# EAGLE schematic shimboard_revC_V4 (EAGLE 9.1.1)

## Sheet 1 of 2
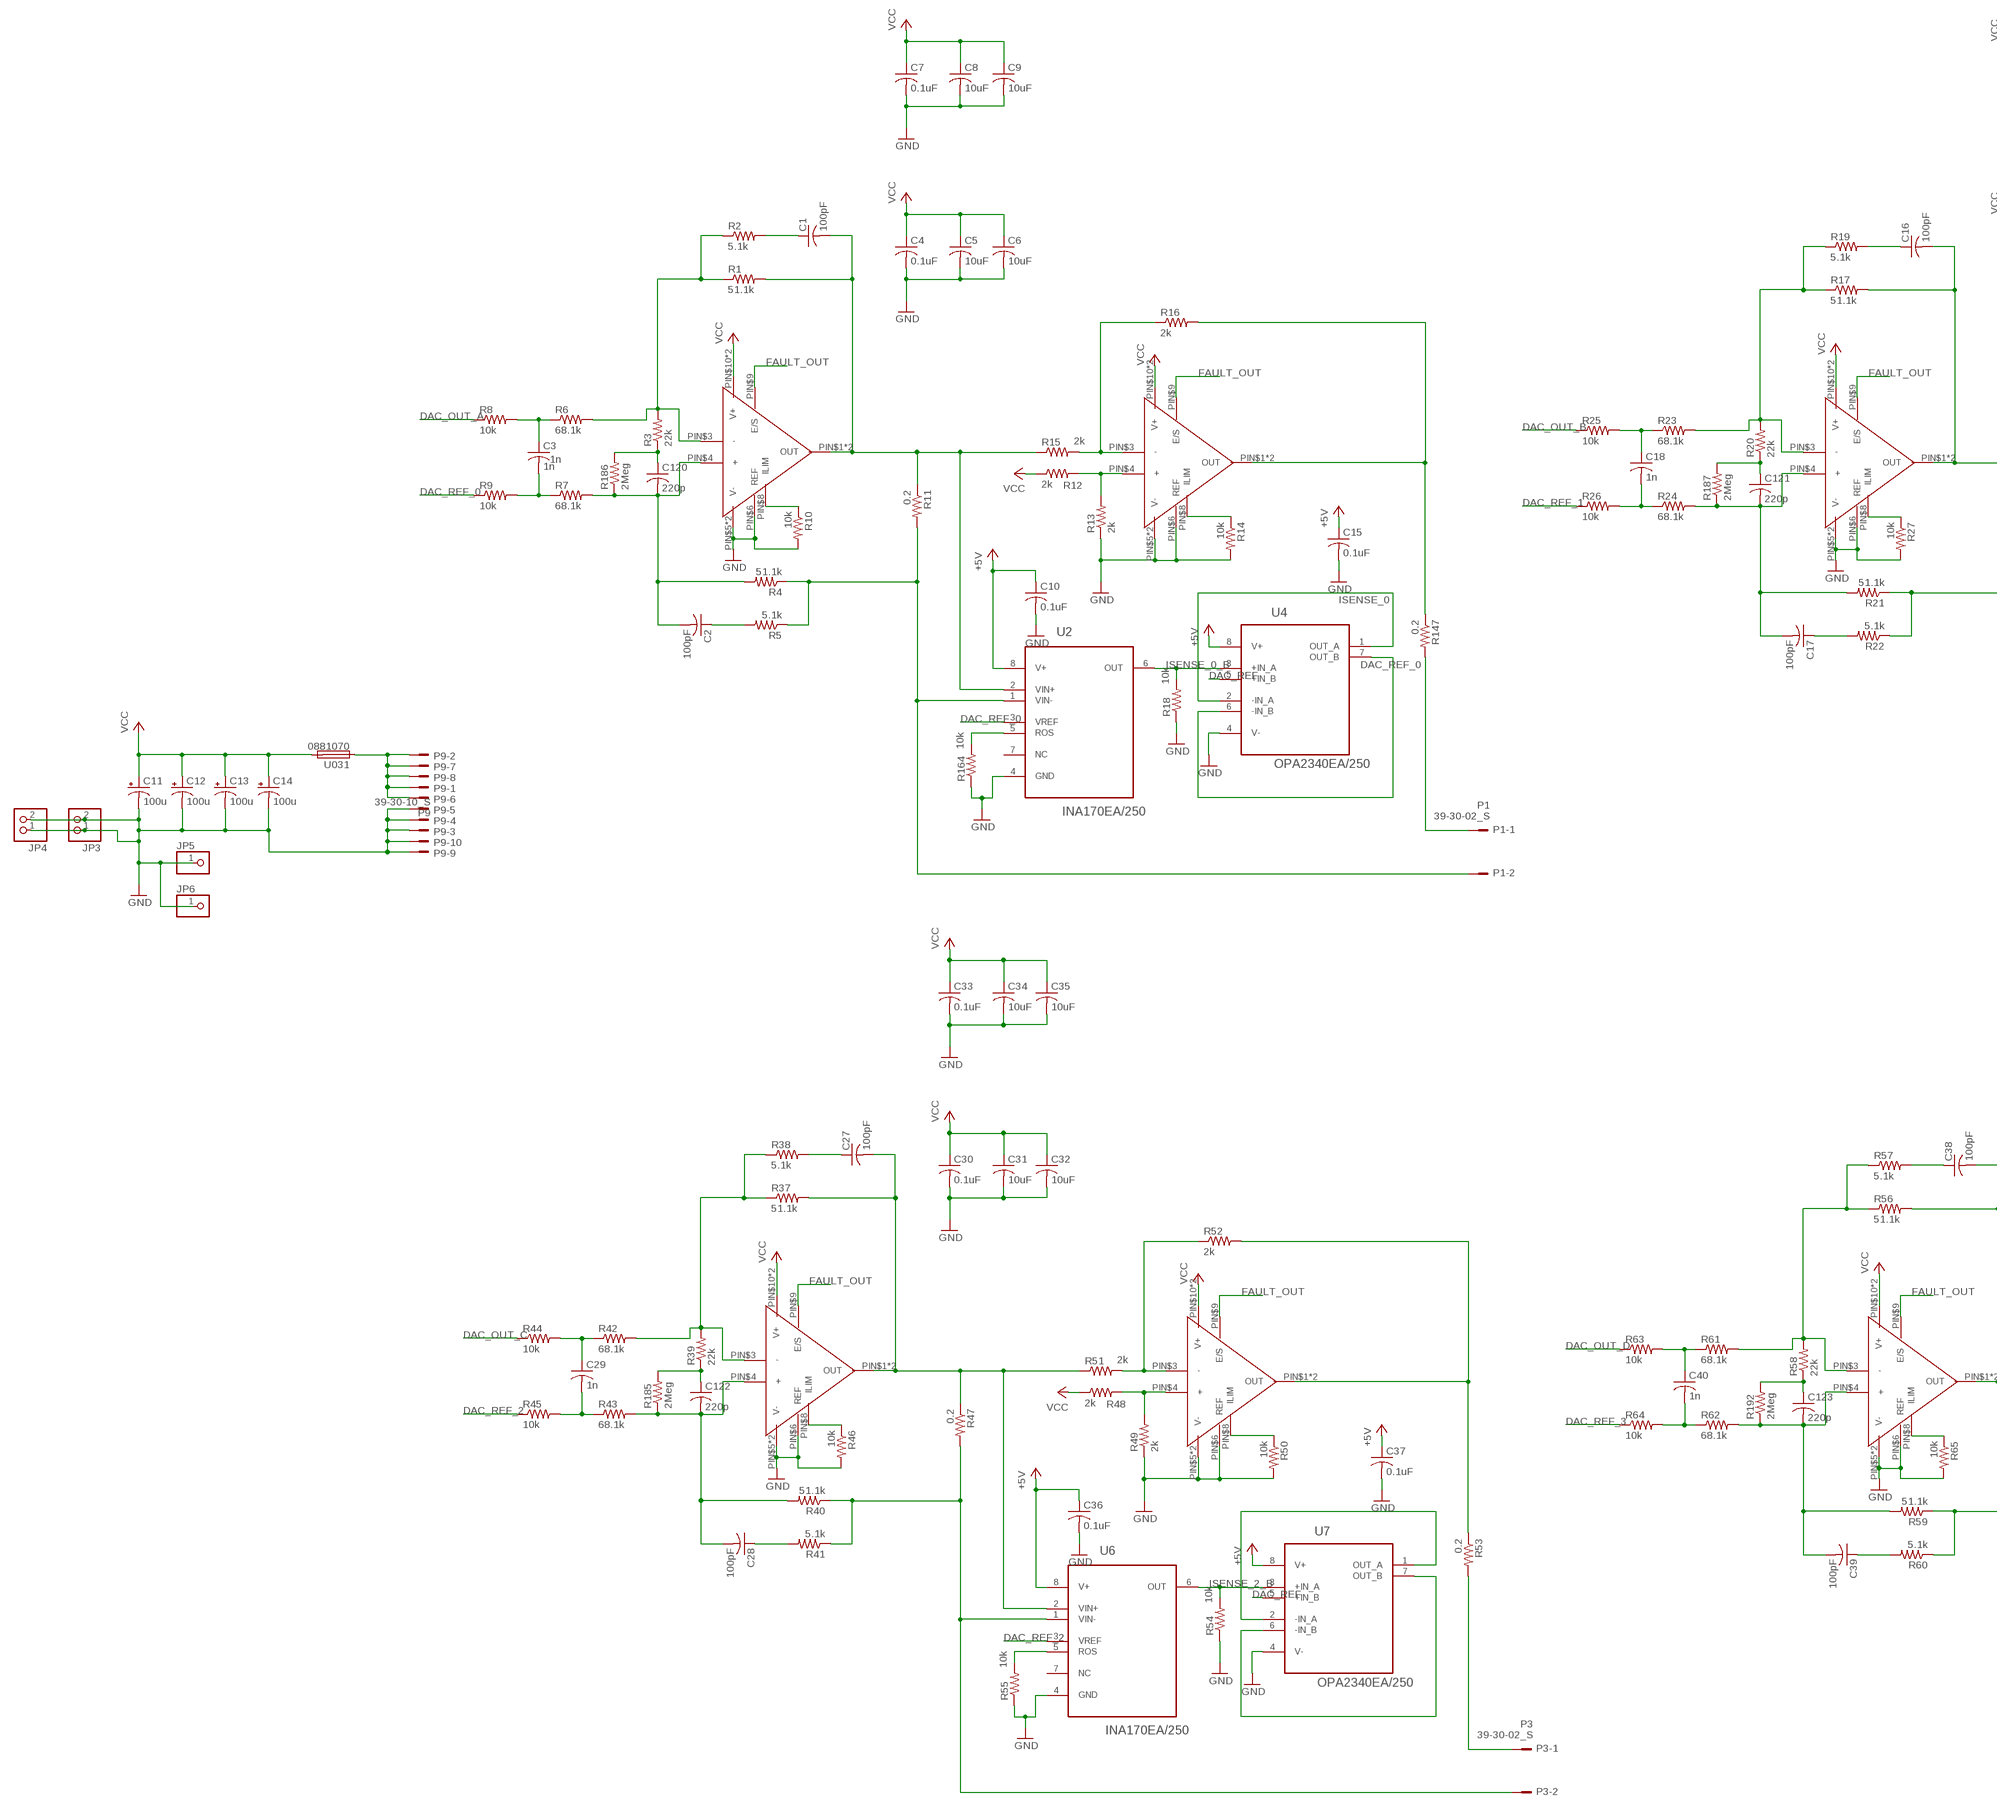
[diagram p0: schematic, sheet 1, part 1 of 3]
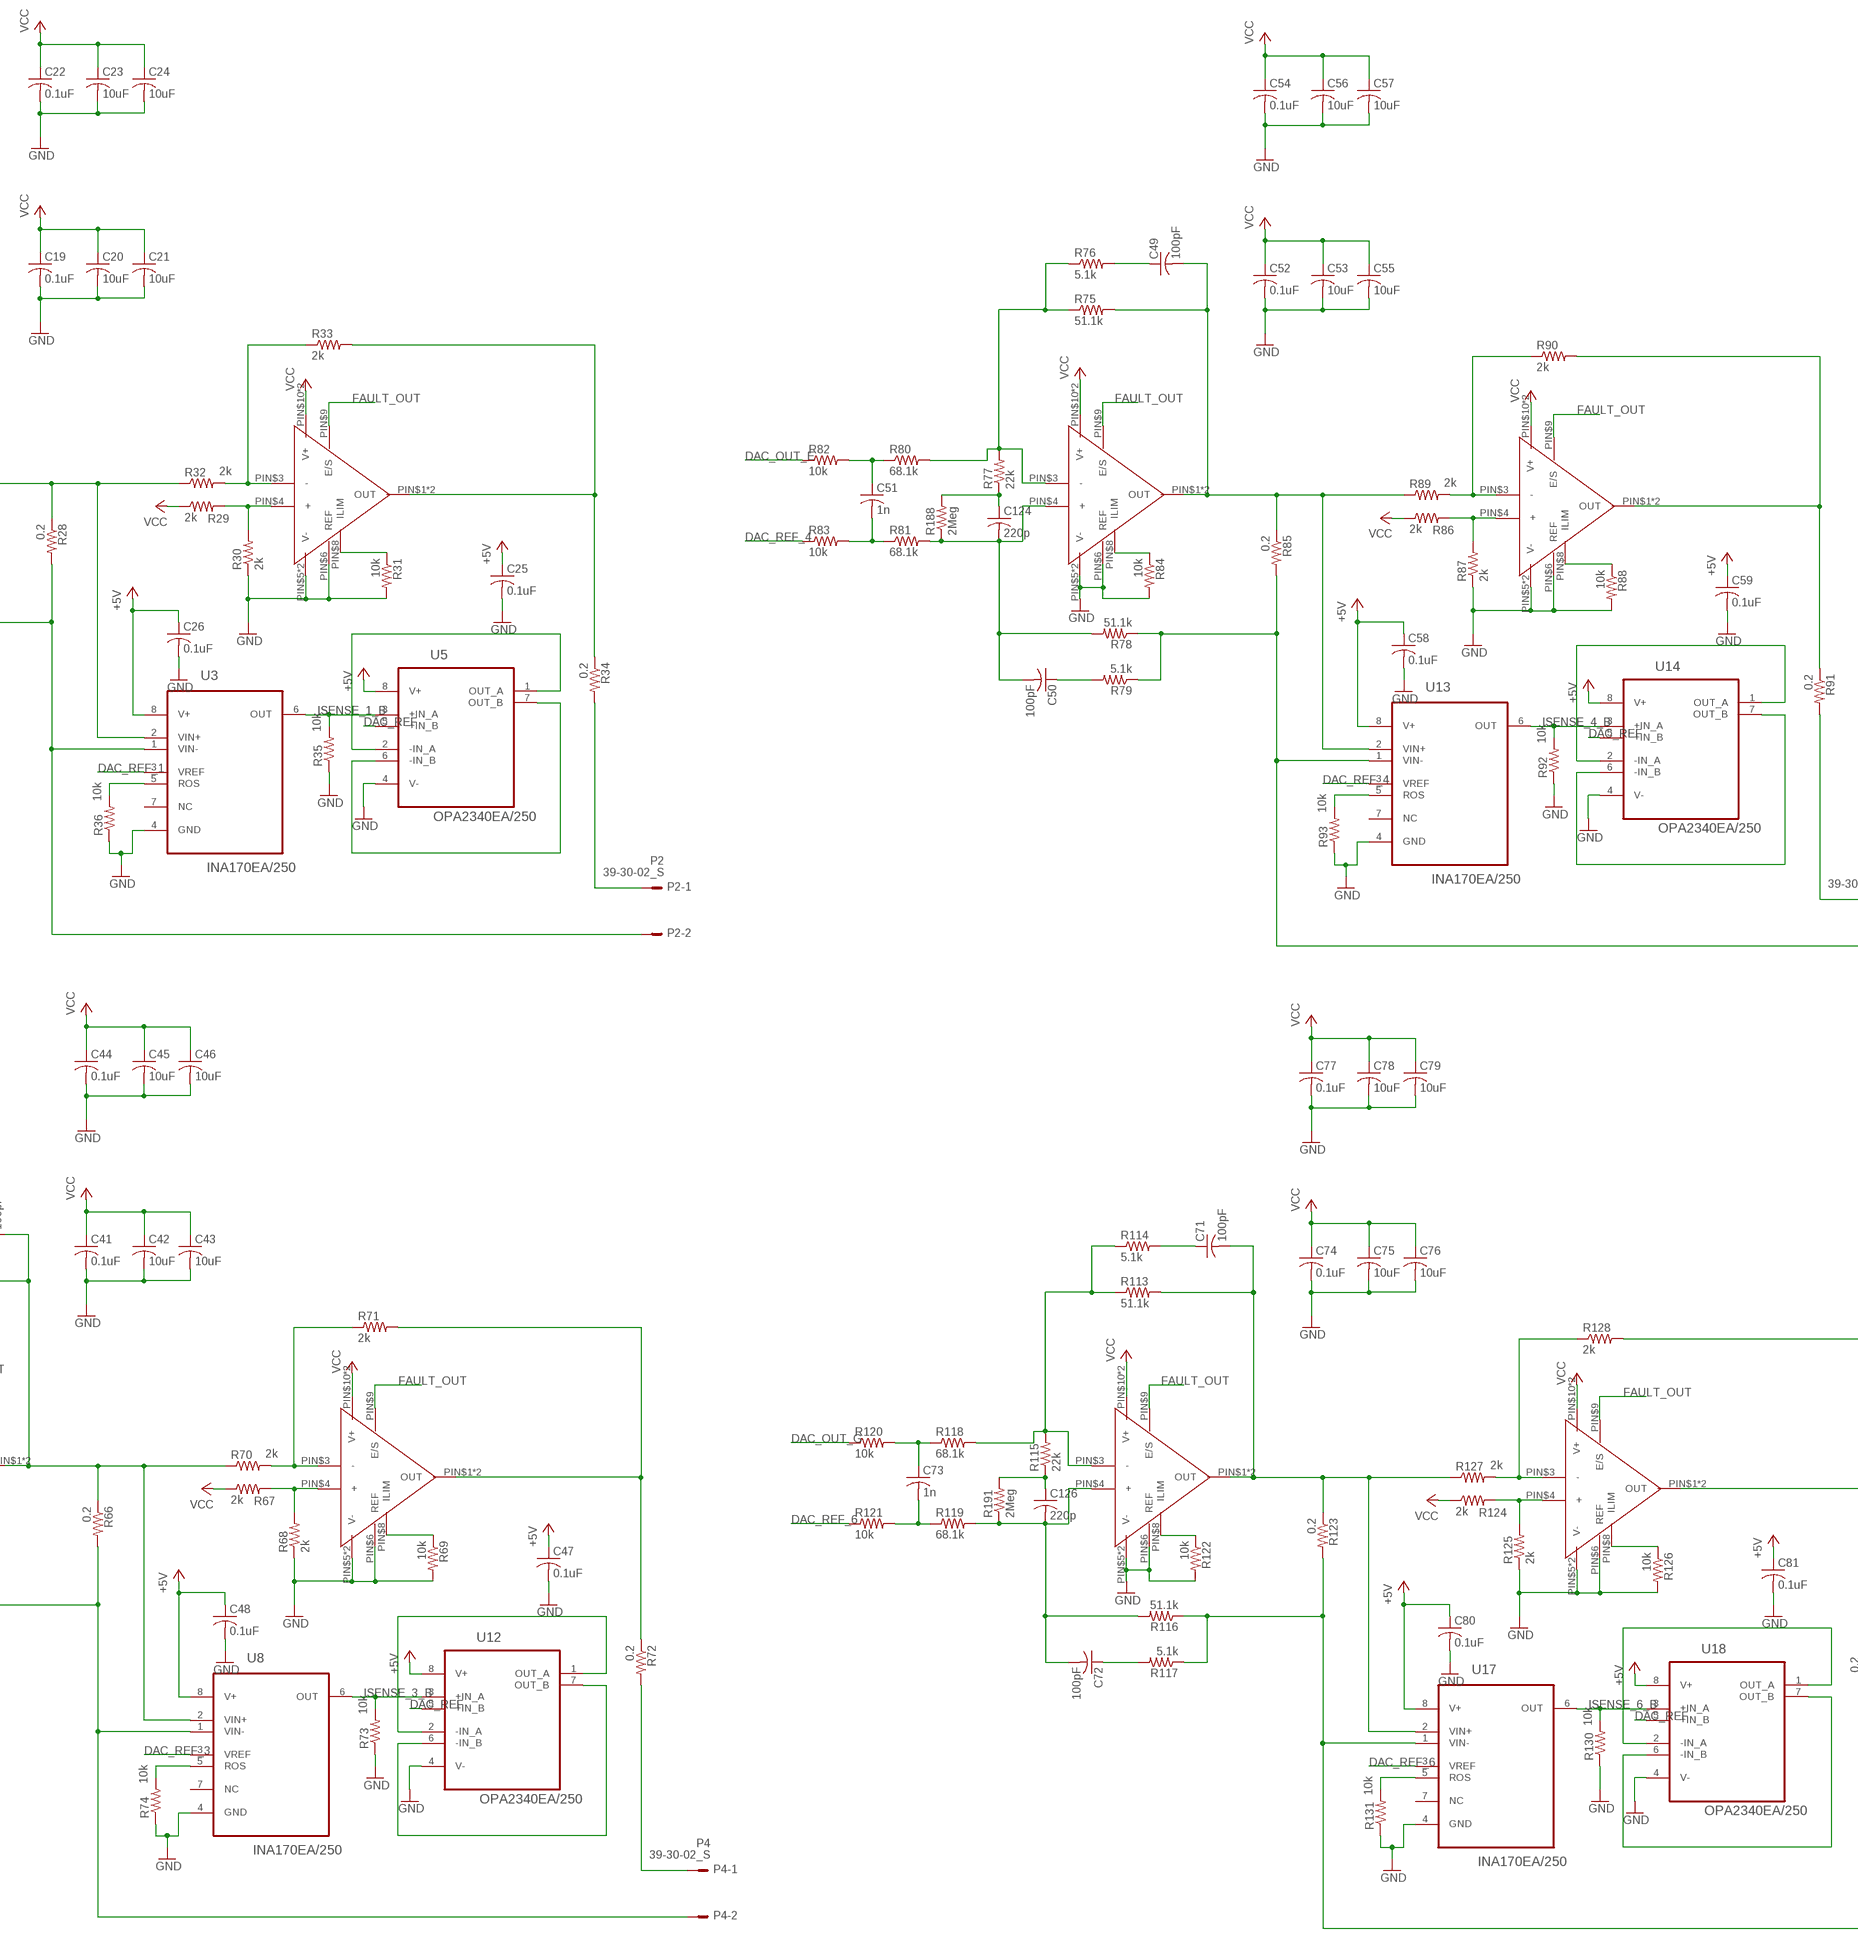
[diagram p1: schematic, sheet 1, part 2 of 3]
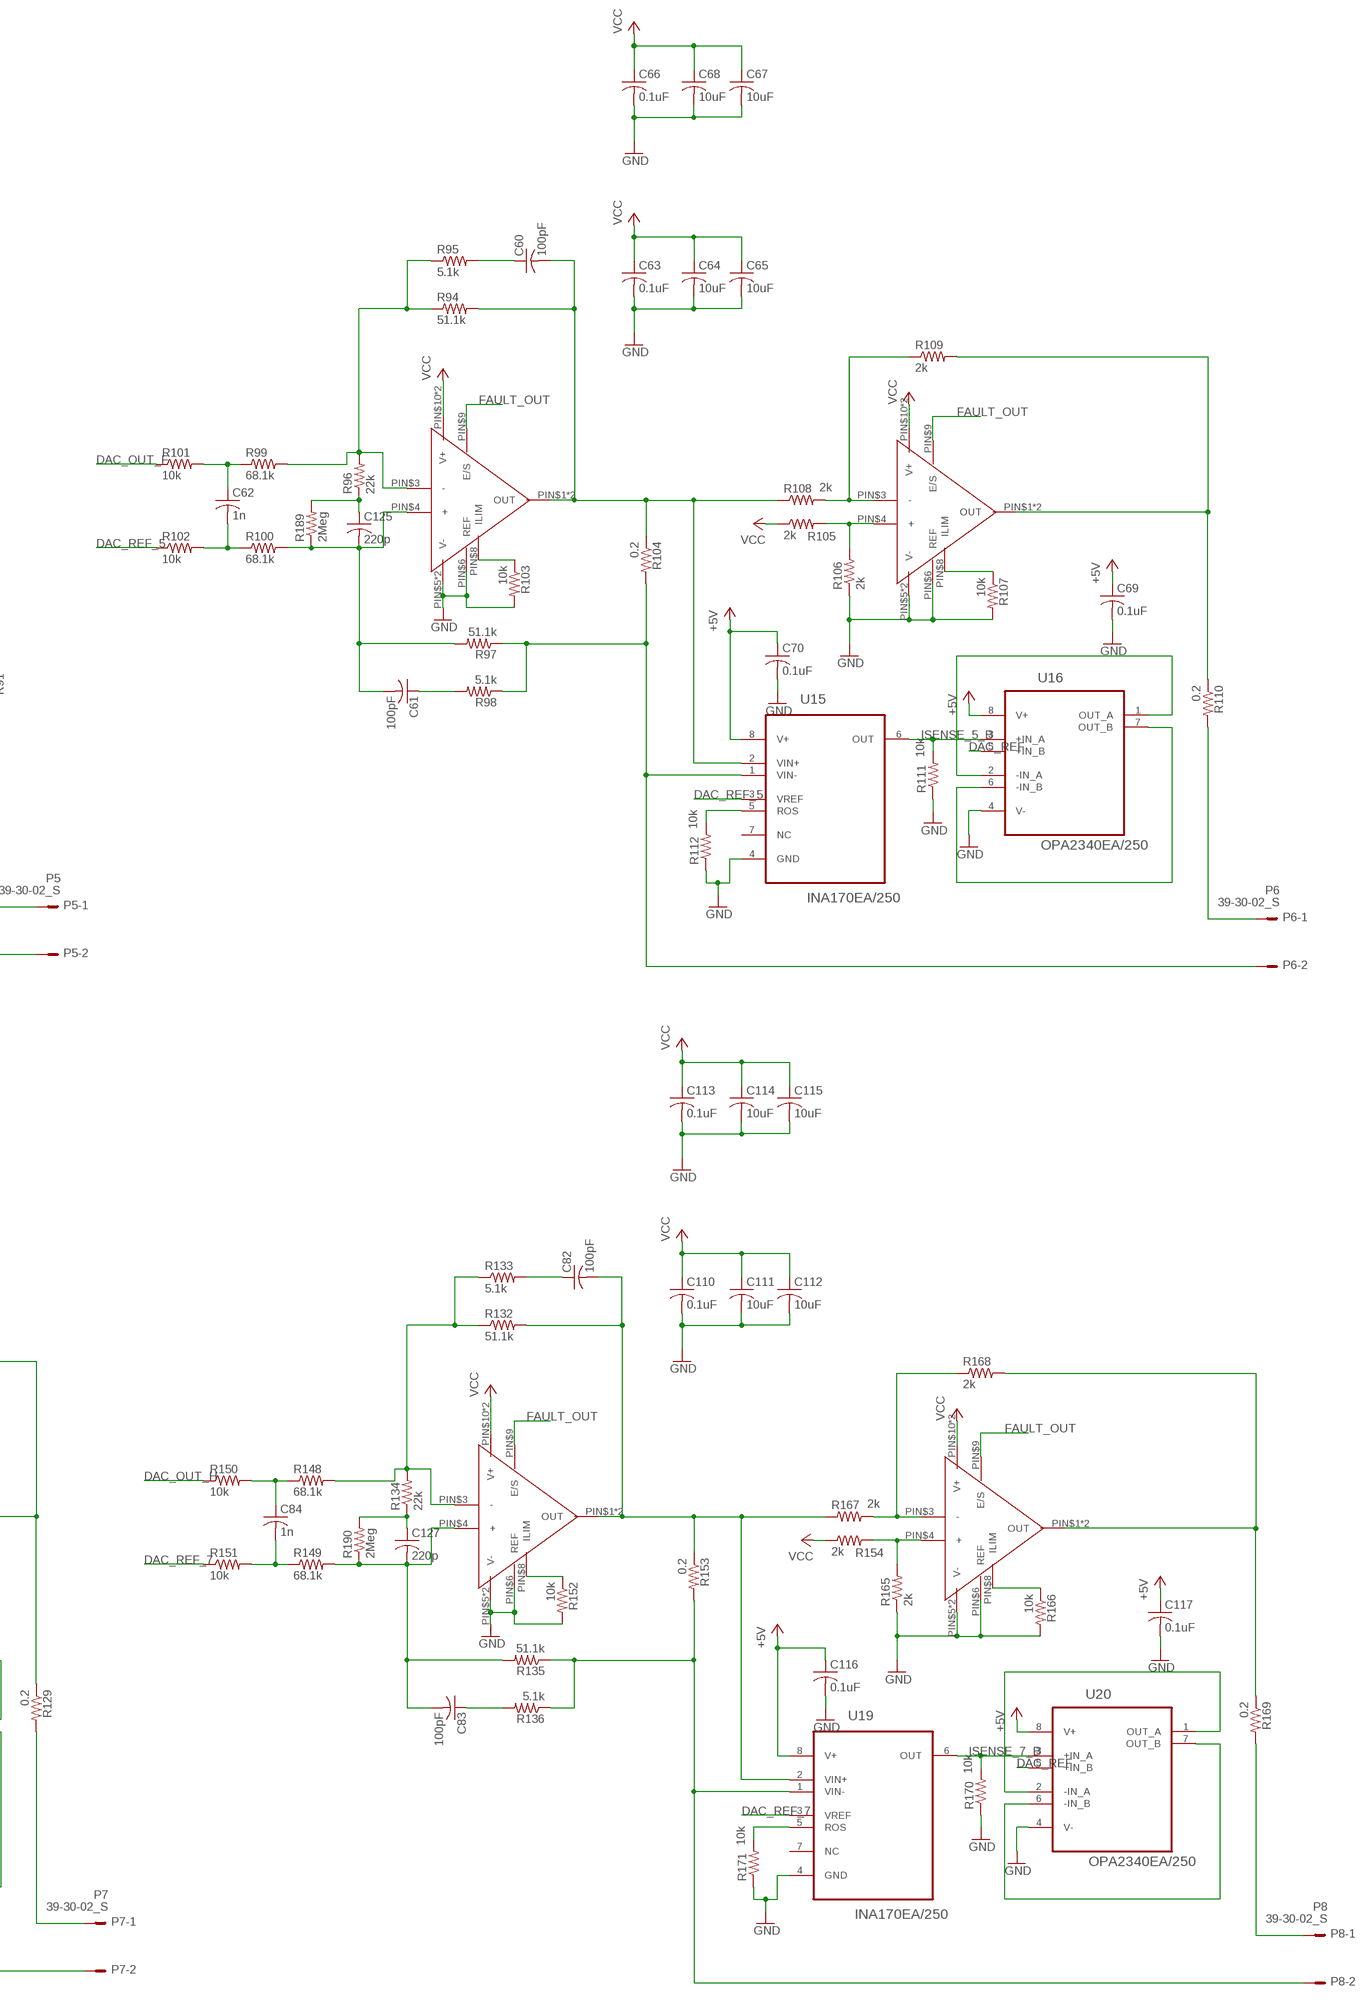
[diagram p2: schematic, sheet 1, part 3 of 3]

### Parts
C1  100pF  C-USC0805  [C0805]
C2  100pF  C-USC0805  [C0805]
C3  1n  C-USC0805  [C0805]
C4  0.1uF  C-USC0805  [C0805]
C5  10uF  C-USC1206  [C1206]
C6  10uF  C-USC1206  [C1206]
C7  0.1uF  C-USC0805  [C0805]
C8  10uF  C-USC1206  [C1206]
C9  10uF  C-USC1206  [C1206]
C10  0.1uF  C-USC0805  [C0805]
C11  100u  CPOL-USD/7343-31W  [D/7343-31W]
C12  100u  CPOL-USD/7343-31W  [D/7343-31W]
C13  100u  CPOL-USD/7343-31W  [D/7343-31W]
C14  100u  CPOL-USD/7343-31W  [D/7343-31W]
C15  0.1uF  C-USC0805  [C0805]
C16  100pF  C-USC0805  [C0805]
C17  100pF  C-USC0805  [C0805]
C18  1n  C-USC0805  [C0805]
C19  0.1uF  C-USC0805  [C0805]
C20  10uF  C-USC1206  [C1206]
C21  10uF  C-USC1206  [C1206]
C22  0.1uF  C-USC0805  [C0805]
C23  10uF  C-USC1206  [C1206]
C24  10uF  C-USC1206  [C1206]
C25  0.1uF  C-USC0805  [C0805]
C26  0.1uF  C-USC0805  [C0805]
C27  100pF  C-USC0805  [C0805]
C28  100pF  C-USC0805  [C0805]
C29  1n  C-USC0805  [C0805]
C30  0.1uF  C-USC0805  [C0805]
C31  10uF  C-USC1206  [C1206]
C32  10uF  C-USC1206  [C1206]
C33  0.1uF  C-USC0805  [C0805]
C34  10uF  C-USC1206  [C1206]
C35  10uF  C-USC1206  [C1206]
C36  0.1uF  C-USC0805  [C0805]
C37  0.1uF  C-USC0805  [C0805]
C38  100pF  C-USC0805  [C0805]
C39  100pF  C-USC0805  [C0805]
C40  1n  C-USC0805  [C0805]
C41  0.1uF  C-USC0805  [C0805]
C42  10uF  C-USC1206  [C1206]
C43  10uF  C-USC1206  [C1206]
C44  0.1uF  C-USC0805  [C0805]
C45  10uF  C-USC1206  [C1206]
C46  10uF  C-USC1206  [C1206]
C47  0.1uF  C-USC0805  [C0805]
C48  0.1uF  C-USC0805  [C0805]
C49  100pF  C-USC0805  [C0805]
C50  100pF  C-USC0805  [C0805]
C51  1n  C-USC0805  [C0805]
C52  0.1uF  C-USC0805  [C0805]
C53  10uF  C-USC1206  [C1206]
C54  0.1uF  C-USC0805  [C0805]
C55  10uF  C-USC1206  [C1206]
C56  10uF  C-USC1206  [C1206]
C57  10uF  C-USC1206  [C1206]
C58  0.1uF  C-USC0805  [C0805]
C59  0.1uF  C-USC0805  [C0805]
C60  100pF  C-USC0805  [C0805]
C61  100pF  C-USC0805  [C0805]
C62  1n  C-USC0805  [C0805]
C63  0.1uF  C-USC0805  [C0805]
C64  10uF  C-USC1206  [C1206]
C65  10uF  C-USC1206  [C1206]
C66  0.1uF  C-USC0805  [C0805]
C67  10uF  C-USC1206  [C1206]
C68  10uF  C-USC1206  [C1206]
C69  0.1uF  C-USC0805  [C0805]
C70  0.1uF  C-USC0805  [C0805]
C71  100pF  C-USC0805  [C0805]
C72  100pF  C-USC0805  [C0805]
C73  1n  C-USC0805  [C0805]
C74  0.1uF  C-USC0805  [C0805]
C75  10uF  C-USC1206  [C1206]
C76  10uF  C-USC1206  [C1206]
C77  0.1uF  C-USC0805  [C0805]
C78  10uF  C-USC1206  [C1206]
C79  10uF  C-USC1206  [C1206]
C80  0.1uF  C-USC0805  [C0805]
C81  0.1uF  C-USC0805  [C0805]
C82  100pF  C-USC0805  [C0805]
C83  100pF  C-USC0805  [C0805]
C84  1n  C-USC0805  [C0805]
C110  0.1uF  C-USC0805  [C0805]
C111  10uF  C-USC1206  [C1206]
C112  10uF  C-USC1206  [C1206]
C113  0.1uF  C-USC0805  [C0805]
C114  10uF  C-USC1206  [C1206]
C115  10uF  C-USC1206  [C1206]
C116  0.1uF  C-USC0805  [C0805]
C117  0.1uF  C-USC0805  [C0805]
C120  220p  C-USC0805  [C0805]
C121  220p  C-USC0805  [C0805]
C122  220p  C-USC0805  [C0805]
C123  220p  C-USC0805  [C0805]
C124  220p  C-USC0805  [C0805]
C125  220p  C-USC0805  [C0805]
C126  220p  C-USC0805  [C0805]
C127  220p  C-USC0805  [C0805]
JP3  PINHD-1X2  [1X02]
JP4  PINHD-1X2  [1X02]
JP5  PINHD-1X1  [1X01]
JP6  PINHD-1X1  [1X01]
P1  39-30-02_S  [39-30-?02?]
P2  39-30-02_S  [39-30-?02?]
P3  39-30-02_S  [39-30-?02?]
P4  39-30-02_S  [39-30-?02?]
P5  39-30-02_S  [39-30-?02?]
P6  39-30-02_S  [39-30-?02?]
P7  39-30-02_S  [39-30-?02?]
P8  39-30-02_S  [39-30-?02?]
P9  39-30-10_S  [39-30-?10?]
R1  51.1k  R-US_R0805  [R0805]
R2  5.1k  R-US_R0805  [R0805]
R3  22k  R-US_R0805  [R0805]
R4  51.1k  R-US_R0805  [R0805]
R5  5.1k  R-US_R0805  [R0805]
R6  68.1k  R-US_R0805  [R0805]
R7  68.1k  R-US_R0805  [R0805]
R8  10k  R-US_R0805  [R0805]
R9  10k  R-US_R0805  [R0805]
R10  10k  R-US_R0805  [R0805]
R11  0.2  R-US_R4527  [R4527]
R12  2k  R-US_M0805  [M0805]
R13  2k  R-US_R0805  [R0805]
R14  10k  R-US_R0805  [R0805]
R15  2k  R-US_R0805  [R0805]
R16  2k  R-US_R0805  [R0805]
R17  51.1k  R-US_R0805  [R0805]
R18  10k  R-US_R0805  [R0805]
R19  5.1k  R-US_R0805  [R0805]
R20  22k  R-US_R0805  [R0805]
R21  51.1k  R-US_R0805  [R0805]
R22  5.1k  R-US_R0805  [R0805]
R23  68.1k  R-US_R0805  [R0805]
R24  68.1k  R-US_R0805  [R0805]
R25  10k  R-US_R0805  [R0805]
R26  10k  R-US_R0805  [R0805]
R27  10k  R-US_R0805  [R0805]
R28  0.2  R-US_R4527  [R4527]
R29  2k  R-US_M0805  [M0805]
R30  2k  R-US_R0805  [R0805]
R31  10k  R-US_R0805  [R0805]
R32  2k  R-US_R0805  [R0805]
R33  2k  R-US_R0805  [R0805]
R34  0.2  R-US_R4527  [R4527]
R35  10k  R-US_R0805  [R0805]
R36  10k  R-US_R0805  [R0805]
R37  51.1k  R-US_R0805  [R0805]
R38  5.1k  R-US_R0805  [R0805]
R39  22k  R-US_R0805  [R0805]
R40  51.1k  R-US_R0805  [R0805]
R41  5.1k  R-US_R0805  [R0805]
R42  68.1k  R-US_R0805  [R0805]
R43  68.1k  R-US_R0805  [R0805]
R44  10k  R-US_R0805  [R0805]
R45  10k  R-US_R0805  [R0805]
R46  10k  R-US_R0805  [R0805]
R47  0.2  R-US_R4527  [R4527]
R48  2k  R-US_M0805  [M0805]
R49  2k  R-US_R0805  [R0805]
R50  10k  R-US_R0805  [R0805]
R51  2k  R-US_R0805  [R0805]
R52  2k  R-US_R0805  [R0805]
R53  0.2  R-US_R4527  [R4527]
R54  10k  R-US_R0805  [R0805]
R55  10k  R-US_R0805  [R0805]
R56  51.1k  R-US_R0805  [R0805]
R57  5.1k  R-US_R0805  [R0805]
R58  22k  R-US_R0805  [R0805]
R59  51.1k  R-US_R0805  [R0805]
R60  5.1k  R-US_R0805  [R0805]
R61  68.1k  R-US_R0805  [R0805]
R62  68.1k  R-US_R0805  [R0805]
R63  10k  R-US_R0805  [R0805]
R64  10k  R-US_R0805  [R0805]
R65  10k  R-US_R0805  [R0805]
R66  0.2  R-US_R4527  [R4527]
R67  2k  R-US_M0805  [M0805]
R68  2k  R-US_R0805  [R0805]
R69  10k  R-US_R0805  [R0805]
R70  2k  R-US_R0805  [R0805]
R71  2k  R-US_R0805  [R0805]
R72  0.2  R-US_R4527  [R4527]
R73  10k  R-US_R0805  [R0805]
R74  10k  R-US_R0805  [R0805]
R75  51.1k  R-US_R0805  [R0805]
R76  5.1k  R-US_R0805  [R0805]
R77  22k  R-US_R0805  [R0805]
R78  51.1k  R-US_R0805  [R0805]
R79  5.1k  R-US_R0805  [R0805]
R80  68.1k  R-US_R0805  [R0805]
R81  68.1k  R-US_R0805  [R0805]
R82  10k  R-US_R0805  [R0805]
R83  10k  R-US_R0805  [R0805]
R84  10k  R-US_R0805  [R0805]
R85  0.2  R-US_R4527  [R4527]
R86  2k  R-US_M0805  [M0805]
R87  2k  R-US_R0805  [R0805]
R88  10k  R-US_R0805  [R0805]
R89  2k  R-US_R0805  [R0805]
R90  2k  R-US_R0805  [R0805]
R91  0.2  R-US_R4527  [R4527]
R92  10k  R-US_R0805  [R0805]
R93  10k  R-US_R0805  [R0805]
R94  51.1k  R-US_R0805  [R0805]
R95  5.1k  R-US_R0805  [R0805]
R96  22k  R-US_R0805  [R0805]
R97  51.1k  R-US_R0805  [R0805]
R98  5.1k  R-US_R0805  [R0805]
R99  68.1k  R-US_R0805  [R0805]
R100  68.1k  R-US_R0805  [R0805]
R101  10k  R-US_R0805  [R0805]
R102  10k  R-US_R0805  [R0805]
R103  10k  R-US_R0805  [R0805]
R104  0.2  R-US_R4527  [R4527]
R105  2k  R-US_M0805  [M0805]
R106  2k  R-US_R0805  [R0805]
R107  10k  R-US_R0805  [R0805]
R108  2k  R-US_R0805  [R0805]
R109  2k  R-US_R0805  [R0805]
R110  0.2  R-US_R4527  [R4527]
R111  10k  R-US_R0805  [R0805]
R112  10k  R-US_R0805  [R0805]
R113  51.1k  R-US_R0805  [R0805]
R114  5.1k  R-US_R0805  [R0805]
R115  22k  R-US_R0805  [R0805]
R116  51.1k  R-US_R0805  [R0805]
R117  5.1k  R-US_R0805  [R0805]
R118  68.1k  R-US_R0805  [R0805]
R119  68.1k  R-US_R0805  [R0805]
R120  10k  R-US_R0805  [R0805]
R121  10k  R-US_R0805  [R0805]
R122  10k  R-US_R0805  [R0805]
R123  0.2  R-US_R4527  [R4527]
R124  2k  R-US_M0805  [M0805]
R125  2k  R-US_R0805  [R0805]
R126  10k  R-US_R0805  [R0805]
R127  2k  R-US_R0805  [R0805]
R128  2k  R-US_R0805  [R0805]
R129  0.2  R-US_R4527  [R4527]
R130  10k  R-US_R0805  [R0805]
R131  10k  R-US_R0805  [R0805]
R132  51.1k  R-US_R0805  [R0805]
R133  5.1k  R-US_R0805  [R0805]
R134  22k  R-US_R0805  [R0805]
R135  51.1k  R-US_R0805  [R0805]
R136  5.1k  R-US_R0805  [R0805]
R147  0.2  R-US_R4527  [R4527]
R148  68.1k  R-US_R0805  [R0805]
R149  68.1k  R-US_R0805  [R0805]
R150  10k  R-US_R0805  [R0805]
R151  10k  R-US_R0805  [R0805]
R152  10k  R-US_R0805  [R0805]
R153  0.2  R-US_R4527  [R4527]
R154  2k  R-US_M0805  [M0805]
R164  10k  R-US_R0805  [R0805]
R165  2k  R-US_R0805  [R0805]
R166  10k  R-US_R0805  [R0805]
R167  2k  R-US_R0805  [R0805]
R168  2k  R-US_R0805  [R0805]
R169  0.2  R-US_R4527  [R4527]
R170  10k  R-US_R0805  [R0805]
R171  10k  R-US_R0805  [R0805]
R185  2Meg  R-US_R0805  [R0805]
R186  2Meg  R-US_R0805  [R0805]
R187  2Meg  R-US_R0805  [R0805]
R188  2Meg  R-US_R0805  [R0805]
R189  2Meg  R-US_R0805  [R0805]
R190  2Meg  R-US_R0805  [R0805]
R191  2Meg  R-US_R0805  [R0805]
R192  2Meg  R-US_R0805  [R0805]
U2  INA170EA/250  [SOP65P490X110-8N]
U3  INA170EA/250  [SOP65P490X110-8N]
U4  OPA2340EA/250  [SOP65P490X110-8N]
U5  OPA2340EA/250  [SOP65P490X110-8N]
U6  INA170EA/250  [SOP65P490X110-8N]
U7  OPA2340EA/250  [SOP65P490X110-8N]
U8  INA170EA/250  [SOP65P490X110-8N]
U12  OPA2340EA/250  [SOP65P490X110-8N]
U13  INA170EA/250  [SOP65P490X110-8N]
U14  OPA2340EA/250  [SOP65P490X110-8N]
U15  INA170EA/250  [SOP65P490X110-8N]
U16  OPA2340EA/250  [SOP65P490X110-8N]
U17  INA170EA/250  [SOP65P490X110-8N]
U18  OPA2340EA/250  [SOP65P490X110-8N]
U19  INA170EA/250  [SOP65P490X110-8N]
U20  OPA2340EA/250  [SOP65P490X110-8N]
U031  0881070  [881]
U$1  OPA549_HS677NOHS  [OPA549]
U$2  OPA549_HS677NOHS  [OPA549]
U$3  OPA549_HS677NOHS  [OPA549]
U$4  OPA549_HS677NOHS  [OPA549]
U$5  OPA549_HS677NOHS  [OPA549]
U$6  OPA549_HS677NOHS  [OPA549]
U$7  OPA549_HS677NOHS  [OPA549]
U$8  OPA549_HS677NOHS  [OPA549]
U$9  OPA549_HS677NOHS  [OPA549]
U$10  OPA549_HS677NOHS  [OPA549]
U$11  OPA549_HS677NOHS  [OPA549]
U$12  OPA549_HS677NOHS  [OPA549]
U$13  OPA549_HS677NOHS  [OPA549]
U$14  OPA549_HS677NOHS  [OPA549]
U$15  OPA549_HS677NOHS  [OPA549]
U$16  OPA549_HS677NOHS  [OPA549]

### Nets
+5V: C10.1 C15.1 C25.1 C26.1 C36.1 C37.1 C47.1 C48.1 C58.1 C59.1 C69.1 C70.1 C80.1 C81.1 C116.1 C117.1 U2.8(V+) U3.8(V+) U4.8(V+) U5.8(V+) U6.8(V+) U7.8(V+) U8.8(V+) U12.8(V+) U13.8(V+) U14.8(V+) U15.8(V+) U16.8(V+) U17.8(V+) U18.8(V+) U19.8(V+) U20.8(V+) ; also sheet 2
C0_O0: P1.2 R4.1 R5.1 R11.2 U2.1(VIN-)
C0_O1: P1.1 R147.2
C1_O0: P2.2 R21.1 R22.1 R28.2 U3.1(VIN-)
C1_O1: P2.1 R34.2
C2_O0: P3.2 R40.1 R41.1 R47.2 U6.1(VIN-)
C2_O1: P3.1 R53.2
C3_O0: P4.2 R59.1 R60.1 R66.2 U8.1(VIN-)
C3_O1: P4.1 R72.2
C4_O0: P5.2 R78.1 R79.1 R85.2 U13.1(VIN-)
C4_O1: P5.1 R91.2
C5_O0: P6.2 R97.1 R98.1 R104.2 U15.1(VIN-)
C5_O1: P6.1 R110.2
C6_O0: P7.1 R129.2
C6_O1: P7.2 R116.1 R117.1 R123.2 U17.1(VIN-)
C7_O0: P8.2 R135.1 R136.1 R153.2 U19.1(VIN-)
C7_O1: P8.1 R169.2
DAC_OUT_A: R8.1 ; also sheet 2
DAC_OUT_B: R25.1 ; also sheet 2
DAC_OUT_C: R44.1 ; also sheet 2
DAC_OUT_D: R63.1 ; also sheet 2
DAC_OUT_E: R82.1 ; also sheet 2
DAC_OUT_F: R101.1 ; also sheet 2
DAC_OUT_G: R120.1 ; also sheet 2
DAC_OUT_H: R150.1 ; also sheet 2
DAC_REF: U4.5(+IN_B) U5.5(+IN_B) U7.5(+IN_B) U12.5(+IN_B) U14.5(+IN_B) U16.5(+IN_B) U18.5(+IN_B) U20.5(+IN_B) ; also sheet 2
DAC_REF_0: R9.1 U2.3(VREF) U4.6(-IN_B) U4.7(OUT_B)
DAC_REF_1: R26.1 U3.3(VREF) U5.6(-IN_B) U5.7(OUT_B)
DAC_REF_2: R45.1 U6.3(VREF) U7.6(-IN_B) U7.7(OUT_B)
DAC_REF_3: R64.1 U8.3(VREF) U12.6(-IN_B) U12.7(OUT_B)
DAC_REF_4: R83.1 U13.3(VREF) U14.6(-IN_B) U14.7(OUT_B)
DAC_REF_5: R102.1 U15.3(VREF) U16.6(-IN_B) U16.7(OUT_B)
DAC_REF_6: R121.1 U17.3(VREF) U18.6(-IN_B) U18.7(OUT_B)
DAC_REF_7: R151.1 U19.3(VREF) U20.6(-IN_B) U20.7(OUT_B)
FAULT_OUT: U$1.PIN$9(E/S) U$2.PIN$9(E/S) U$3.PIN$9(E/S) U$4.PIN$9(E/S) U$5.PIN$9(E/S) U$6.PIN$9(E/S) U$7.PIN$9(E/S) U$8.PIN$9(E/S) U$9.PIN$9(E/S) U$10.PIN$9(E/S) U$11.PIN$9(E/S) U$12.PIN$9(E/S) U$13.PIN$9(E/S) U$14.PIN$9(E/S) U$15.PIN$9(E/S) U$16.PIN$9(E/S) ; also sheet 2
GND: C4.2 C5.2 C6.2 C7.2 C8.2 C9.2 C10.2 C11.- C12.- C13.- C14.- C15.2 C19.2 C20.2 C21.2 C22.2 C23.2 C24.2 C25.2 C26.2 C30.2 C31.2 C32.2 C33.2 C34.2 C35.2 C36.2 C37.2 C41.2 C42.2 C43.2 C44.2 C45.2 C46.2 C47.2 C48.2 C52.2 C53.2 C54.2 C55.2 C56.2 C57.2 C58.2 C59.2 C63.2 C64.2 C65.2 C66.2 C67.2 C68.2 C69.2 C70.2 C74.2 C75.2 C76.2 C77.2 C78.2 C79.2 C80.2 C81.2 C110.2 C111.2 C112.2 C113.2 C114.2 C115.2 C116.2 C117.2 JP3.1 JP3.2 JP4.1 JP4.2 JP5.1 JP6.1 P9.3 P9.4 P9.5 P9.9 P9.10 R10.2 R13.1 R14.2 R18.1 R27.2 R30.1 R31.2 R35.1 R36.1 R46.2 R49.1 R50.2 R54.1 R55.1 R65.2 R68.1 R69.2 R73.1 R74.1 R84.2 R87.1 R88.2 R92.1 R93.1 R103.2 R106.1 R107.2 R111.1 R112.1 R122.2 R125.1 R126.2 R130.1 R131.1 R152.2 R164.1 R165.1 R166.2 R170.1 R171.1 U2.4(GND) U3.4(GND) U4.4(V-) U5.4(V-) U6.4(GND) U7.4(V-) U8.4(GND) U12.4(V-) U13.4(GND) U14.4(V-) U15.4(GND) U16.4(V-) U17.4(GND) U18.4(V-) U19.4(GND) U20.4(V-) U$1.PIN$5(V-) U$1.PIN$6(REF) U$1.PIN$7(V-) U$2.PIN$5(V-) U$2.PIN$6(REF) U$2.PIN$7(V-) U$3.PIN$5(V-) U$3.PIN$6(REF) U$3.PIN$7(V-) U$4.PIN$5(V-) U$4.PIN$6(REF) U$4.PIN$7(V-) U$5.PIN$5(V-) U$5.PIN$6(REF) U$5.PIN$7(V-) U$6.PIN$5(V-) U$6.PIN$6(REF) U$6.PIN$7(V-) U$7.PIN$5(V-) U$7.PIN$6(REF) U$7.PIN$7(V-) U$8.PIN$5(V-) U$8.PIN$6(REF) U$8.PIN$7(V-) U$9.PIN$5(V-) U$9.PIN$6(REF) U$9.PIN$7(V-) U$10.PIN$5(V-) U$10.PIN$6(REF) U$10.PIN$7(V-) U$11.PIN$5(V-) U$11.PIN$6(REF) U$11.PIN$7(V-) U$12.PIN$5(V-) U$12.PIN$6(REF) U$12.PIN$7(V-) U$13.PIN$5(V-) U$13.PIN$6(REF) U$13.PIN$7(V-) U$14.PIN$5(V-) U$14.PIN$6(REF) U$14.PIN$7(V-) U$15.PIN$5(V-) U$15.PIN$6(REF) U$15.PIN$7(V-) U$16.PIN$5(V-) U$16.PIN$6(REF) U$16.PIN$7(V-) ; also sheet 2
ISENSE_0: U4.1(OUT_A) U4.2(-IN_A) ; also sheet 2
ISENSE_0_B: R18.2 U2.6(OUT) U4.3(+IN_A)
ISENSE_1: U5.1(OUT_A) U5.2(-IN_A) ; also sheet 2
ISENSE_1_B: R35.2 U3.6(OUT) U5.3(+IN_A)
ISENSE_2: U7.1(OUT_A) U7.2(-IN_A) ; also sheet 2
ISENSE_2_B: R54.2 U6.6(OUT) U7.3(+IN_A)
ISENSE_3: U12.1(OUT_A) U12.2(-IN_A) ; also sheet 2
ISENSE_3_B: R73.2 U8.6(OUT) U12.3(+IN_A)
ISENSE_4: U14.1(OUT_A) U14.2(-IN_A) ; also sheet 2
ISENSE_4_B: R92.2 U13.6(OUT) U14.3(+IN_A)
ISENSE_5: U16.1(OUT_A) U16.2(-IN_A) ; also sheet 2
ISENSE_5_B: R111.2 U15.6(OUT) U16.3(+IN_A)
ISENSE_6: U18.1(OUT_A) U18.2(-IN_A) ; also sheet 2
ISENSE_6_B: R130.2 U17.6(OUT) U18.3(+IN_A)
ISENSE_7: U20.1(OUT_A) U20.2(-IN_A) ; also sheet 2
ISENSE_7_B: R170.2 U19.6(OUT) U20.3(+IN_A)
N$1: R1.1 R2.1 R3.2 R6.2 U$1.PIN$3(-)
N$2: C1.1 R2.2
N$3: R17.1 R19.1 R20.2 R23.2 U$3.PIN$3(-)
N$4: C3.2 R7.1 R9.2
N$5: C2.2 C120.2 R4.2 R7.2 R186.1 U$1.PIN$4(+)
N$6: C2.1 R5.2
N$7: C3.1 R6.1 R8.2
N$8: R12.2 R13.2 U$2.PIN$4(+)
N$9: C16.1 R19.2
N$10: C17.2 C121.2 R21.2 R24.2 R187.1 U$3.PIN$4(+)
N$11: R10.1 U$1.PIN$8(ILIM)
N$12: R15.2 R16.1 U$2.PIN$3(-)
N$13: C17.1 R22.2
N$14: R14.1 U$2.PIN$8(ILIM)
N$15: C1.2 R1.2 R11.1 R15.1 U2.2(VIN+) U$1.PIN$1(OUT) U$1.PIN$2(OUT)
N$16: C18.2 R24.1 R26.2
N$17: C18.1 R23.1 R25.2
N$18: R27.1 U$3.PIN$8(ILIM)
N$19: R29.2 R30.2 U$4.PIN$4(+)
N$20: R31.1 U$4.PIN$8(ILIM)
N$21: R32.2 R33.1 U$4.PIN$3(-)
N$22: C16.2 R17.2 R28.1 R32.1 U3.2(VIN+) U$3.PIN$1(OUT) U$3.PIN$2(OUT)
N$23: R33.2 R34.1 U$4.PIN$1(OUT) U$4.PIN$2(OUT)
N$24: R36.2 U3.5(ROS)
N$25: R37.1 R38.1 R39.2 R42.2 U$5.PIN$3(-)
N$26: C27.1 R38.2
N$27: C28.2 C122.2 R40.2 R43.2 R185.1 U$5.PIN$4(+)
N$28: C28.1 R41.2
N$29: C29.2 R43.1 R45.2
N$30: C29.1 R42.1 R44.2
N$31: R46.1 U$5.PIN$8(ILIM)
N$32: R48.2 R49.2 U$6.PIN$4(+)
N$33: R50.1 U$6.PIN$8(ILIM)
N$34: R51.2 R52.1 U$6.PIN$3(-)
N$35: C27.2 R37.2 R47.1 R51.1 U6.2(VIN+) U$5.PIN$1(OUT) U$5.PIN$2(OUT)
N$36: R52.2 R53.1 U$6.PIN$1(OUT) U$6.PIN$2(OUT)
N$37: R55.2 U6.5(ROS)
N$38: R56.1 R57.1 R58.2 R61.2 U$7.PIN$3(-)
N$39: C38.1 R57.2
N$40: C39.2 C123.2 R59.2 R62.2 R192.1 U$7.PIN$4(+)
N$41: C39.1 R60.2
N$42: C40.2 R62.1 R64.2
N$43: C40.1 R61.1 R63.2
N$44: R65.1 U$7.PIN$8(ILIM)
N$45: R67.2 R68.2 U$8.PIN$4(+)
N$46: R69.1 U$8.PIN$8(ILIM)
N$47: R70.2 R71.1 U$8.PIN$3(-)
N$48: C38.2 R56.2 R66.1 R70.1 U8.2(VIN+) U$7.PIN$1(OUT) U$7.PIN$2(OUT)
N$49: R71.2 R72.1 U$8.PIN$1(OUT) U$8.PIN$2(OUT)
N$50: R74.2 U8.5(ROS)
N$51: R75.1 R76.1 R77.2 R80.2 U$9.PIN$3(-)
N$52: C49.1 R76.2
N$53: C50.2 C124.2 R78.2 R81.2 R188.1 U$9.PIN$4(+)
N$54: C50.1 R79.2
N$55: C51.2 R81.1 R83.2
N$56: C51.1 R80.1 R82.2
N$57: R84.1 U$9.PIN$8(ILIM)
N$58: R86.2 R87.2 U$10.PIN$4(+)
N$59: R88.1 U$10.PIN$8(ILIM)
N$60: R89.2 R90.1 U$10.PIN$3(-)
N$61: C49.2 R75.2 R85.1 R89.1 U13.2(VIN+) U$9.PIN$1(OUT) U$9.PIN$2(OUT)
N$62: R90.2 R91.1 U$10.PIN$1(OUT) U$10.PIN$2(OUT)
N$63: R93.2 U13.5(ROS)
N$64: R94.1 R95.1 R96.2 R99.2 U$11.PIN$3(-)
N$65: C60.1 R95.2
N$66: C83.2 C127.2 R135.2 R149.2 R190.1 U$15.PIN$4(+)
N$67: C61.1 R98.2
N$68: C62.2 R100.1 R102.2
N$69: C62.1 R99.1 R101.2
N$70: R103.1 U$11.PIN$8(ILIM)
N$71: R105.2 R106.2 U$12.PIN$4(+)
N$72: R107.1 U$12.PIN$8(ILIM)
N$73: R108.2 R109.1 U$12.PIN$3(-)
N$74: C60.2 R94.2 R104.1 R108.1 U15.2(VIN+) U$11.PIN$1(OUT) U$11.PIN$2(OUT)
N$75: R109.2 R110.1 U$12.PIN$1(OUT) U$12.PIN$2(OUT)
N$76: R112.2 U15.5(ROS)
N$77: R113.1 R114.1 R115.2 R118.2 U$13.PIN$3(-)
N$78: C71.1 R114.2
N$79: C72.2 C126.2 R116.2 R119.2 R191.1 U$13.PIN$4(+)
N$80: C72.1 R117.2
N$81: C73.2 R119.1 R121.2
N$82: C73.1 R118.1 R120.2
N$83: R122.1 U$13.PIN$8(ILIM)
N$84: R124.2 R125.2 U$14.PIN$4(+)
N$85: R126.1 U$14.PIN$8(ILIM)
N$86: R127.2 R128.1 U$14.PIN$3(-)
N$87: C71.2 R113.2 R123.1 R127.1 U17.2(VIN+) U$13.PIN$1(OUT) U$13.PIN$2(OUT)
N$88: R128.2 R129.1 U$14.PIN$1(OUT) U$14.PIN$2(OUT)
N$89: R131.2 U17.5(ROS)
N$90: R132.1 R133.1 R134.2 R148.2 U$15.PIN$3(-)
N$91: C82.1 R133.2
N$93: C83.1 R136.2
N$94: C84.2 R149.1 R151.2
N$95: C84.1 R148.1 R150.2
N$96: R152.1 U$15.PIN$8(ILIM)
N$98: R16.2 R147.1 U$2.PIN$1(OUT) U$2.PIN$2(OUT)
N$99: R154.2 R165.2 U$16.PIN$4(+)
N$101: R166.1 U$16.PIN$8(ILIM)
N$102: R167.2 R168.1 U$16.PIN$3(-)
N$103: C82.2 R132.2 R153.1 R167.1 U19.2(VIN+) U$15.PIN$1(OUT) U$15.PIN$2(OUT)
N$104: R168.2 R169.1 U$16.PIN$1(OUT) U$16.PIN$2(OUT)
N$105: R171.2 U19.5(ROS)
N$108: R164.2 U2.5(ROS)
N$117: C61.2 C125.2 R97.2 R100.2 R189.1 U$11.PIN$4(+)
N$130: C120.1 R3.1 R186.2
N$133: C121.1 R20.1 R187.2
N$148: C124.1 R77.1 R188.2
N$150: C125.1 R96.1 R189.2
N$151: C122.1 R39.1 R185.2
N$152: C123.1 R58.1 R192.2
N$153: C126.1 R115.1 R191.2
N$154: C127.1 R134.1 R190.2
VCC: C4.1 C5.1 C6.1 C7.1 C8.1 C9.1 C11.+ C12.+ C13.+ C14.+ C19.1 C20.1 C21.1 C22.1 C23.1 C24.1 C30.1 C31.1 C32.1 C33.1 C34.1 C35.1 C41.1 C42.1 C43.1 C44.1 C45.1 C46.1 C52.1 C53.1 C54.1 C55.1 C56.1 C57.1 C63.1 C64.1 C65.1 C66.1 C67.1 C68.1 C74.1 C75.1 C76.1 C77.1 C78.1 C79.1 C110.1 C111.1 C112.1 C113.1 C114.1 C115.1 R12.1 R29.1 R48.1 R67.1 R86.1 R105.1 R124.1 R154.1 U031.P$2 U$1.PIN$10(V+) U$1.PIN$11(V+) U$2.PIN$10(V+) U$2.PIN$11(V+) U$3.PIN$10(V+) U$3.PIN$11(V+) U$4.PIN$10(V+) U$4.PIN$11(V+) U$5.PIN$10(V+) U$5.PIN$11(V+) U$6.PIN$10(V+) U$6.PIN$11(V+) U$7.PIN$10(V+) U$7.PIN$11(V+) U$8.PIN$10(V+) U$8.PIN$11(V+) U$9.PIN$10(V+) U$9.PIN$11(V+) U$10.PIN$10(V+) U$10.PIN$11(V+) U$11.PIN$10(V+) U$11.PIN$11(V+) U$12.PIN$10(V+) U$12.PIN$11(V+) U$13.PIN$10(V+) U$13.PIN$11(V+) U$14.PIN$10(V+) U$14.PIN$11(V+) U$15.PIN$10(V+) U$15.PIN$11(V+) U$16.PIN$10(V+) U$16.PIN$11(V+) ; also sheet 2
VCC_I: P9.1 P9.2 P9.6 P9.7 P9.8 U031.P$1
Unconnected: U2.7(NC) U3.7(NC) U6.7(NC) U8.7(NC) U13.7(NC) U15.7(NC) U17.7(NC) U19.7(NC)

## Sheet 2 of 2
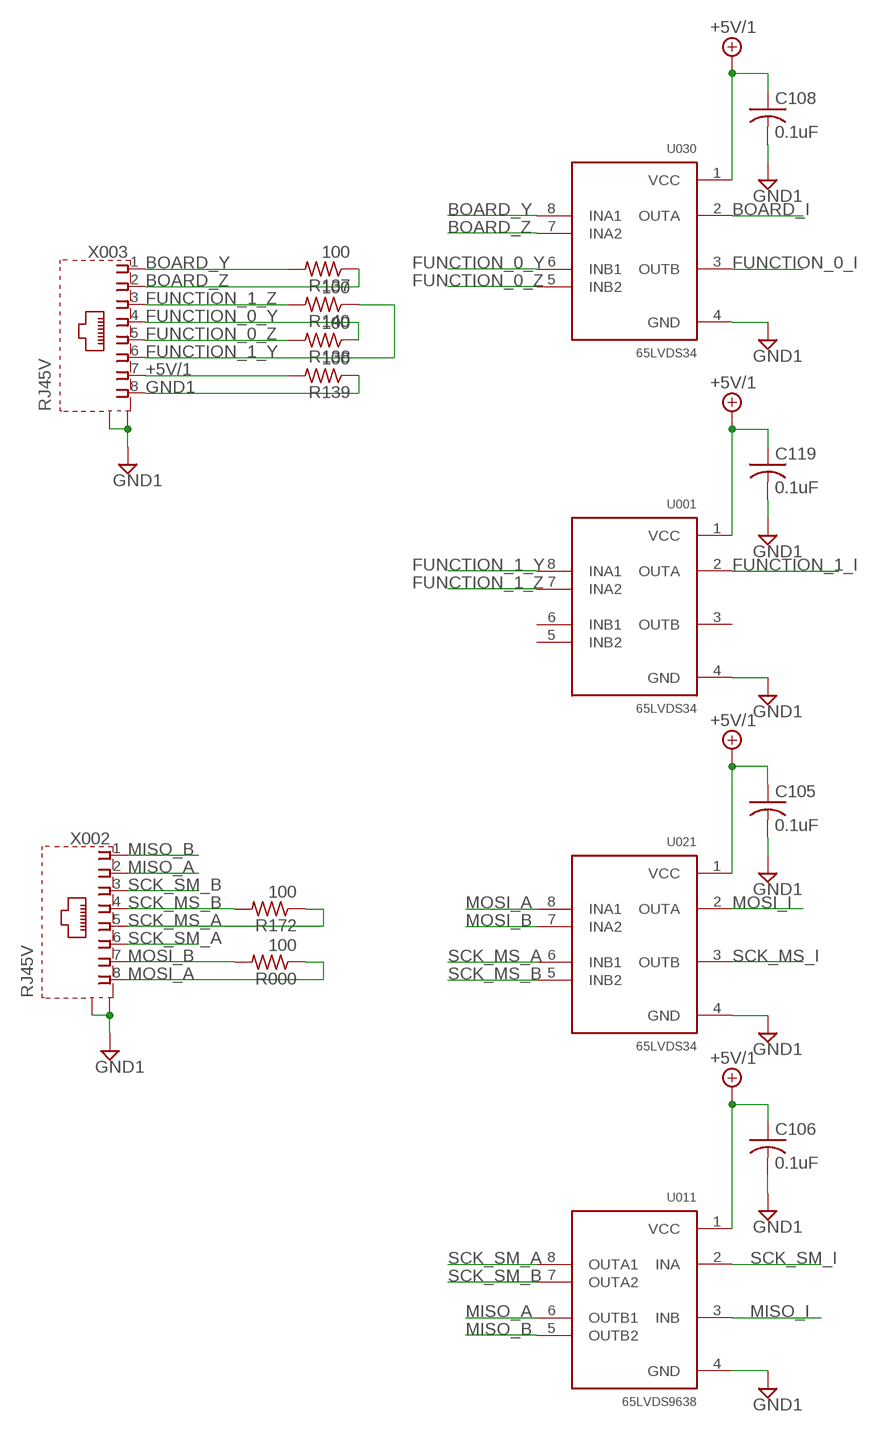
[diagram p3: schematic, sheet 2, part 1 of 2]
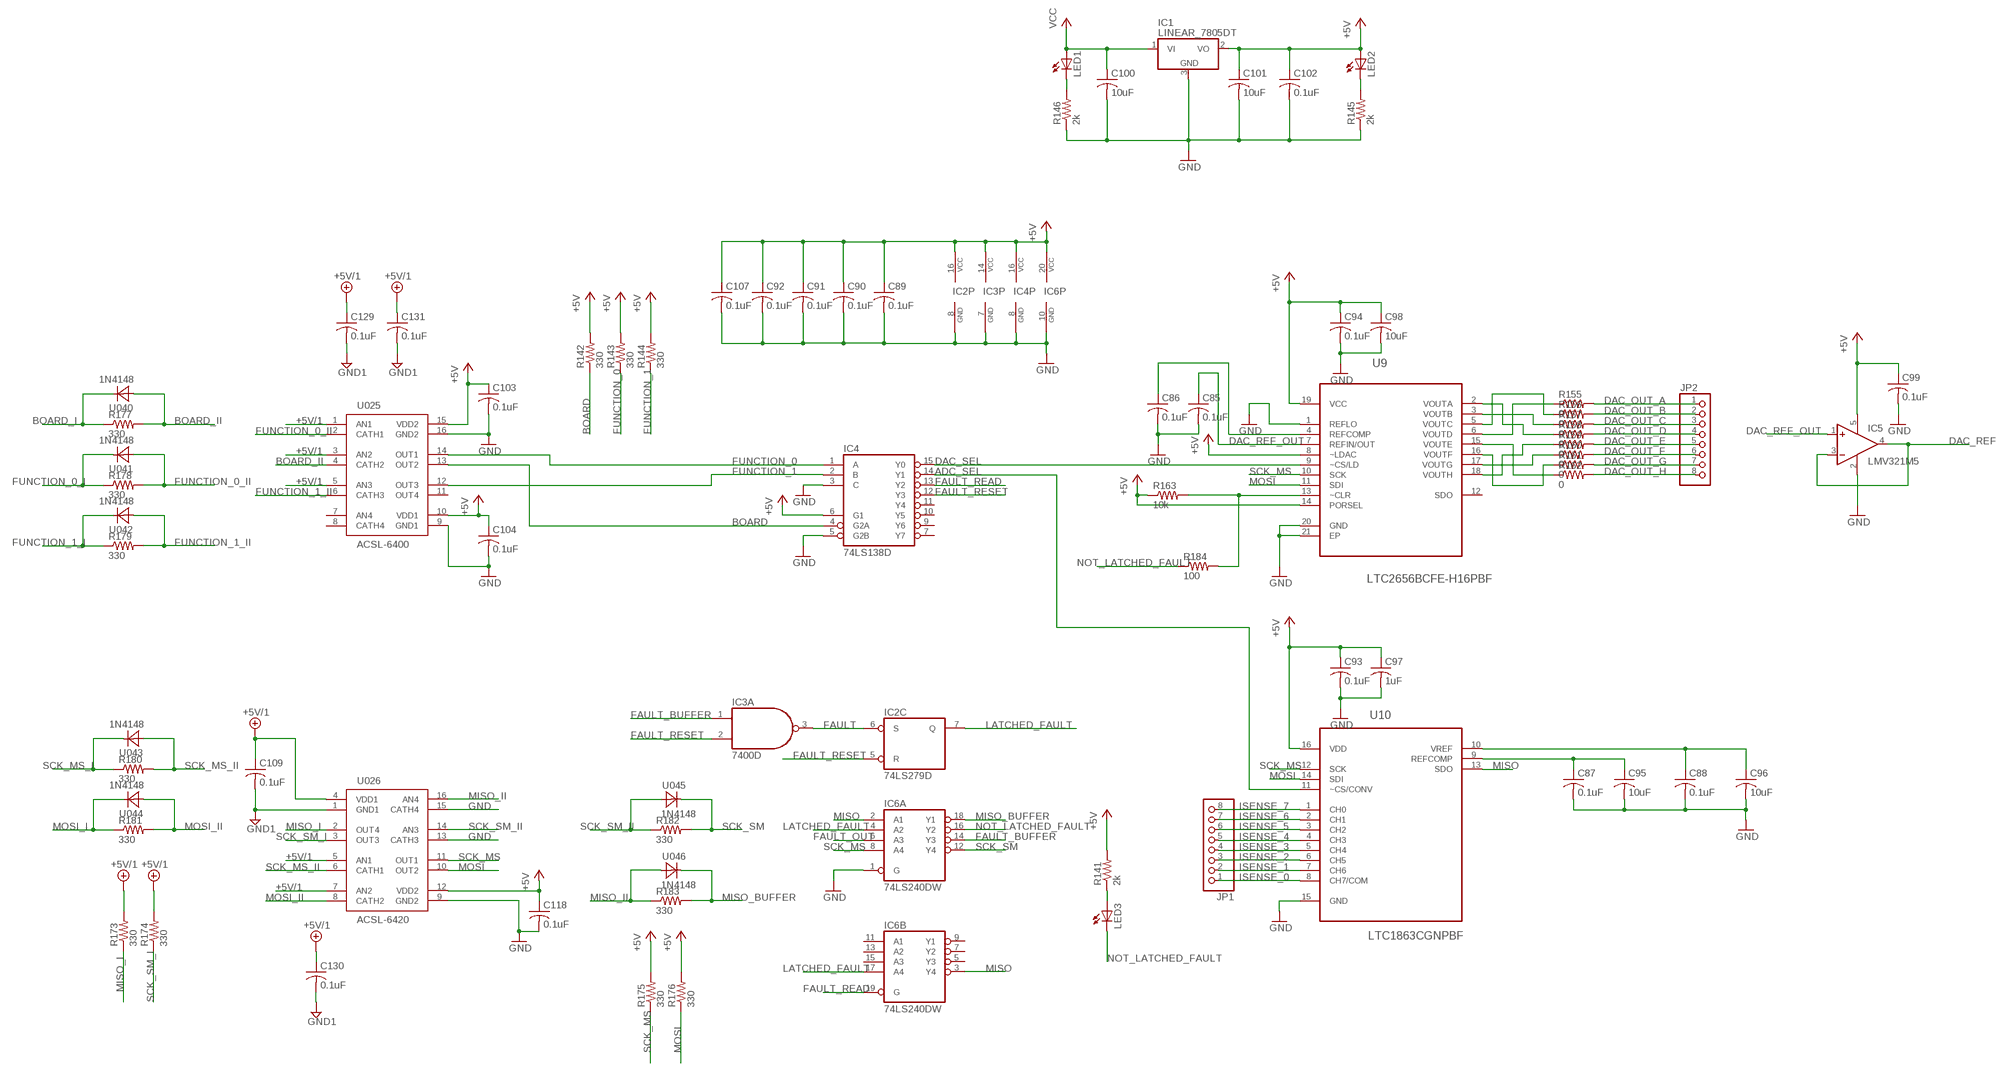
[diagram p4: schematic, sheet 2, part 2 of 2]

### Parts
C85  0.1uF  C-USC0603  [C0603]
C86  0.1uF  C-USC0603  [C0603]
C87  0.1uF  C-USC0603  [C0603]
C88  0.1uF  C-USC0603  [C0603]
C89  0.1uF  C-USC0603  [C0603]
C90  0.1uF  C-USC0603  [C0603]
C91  0.1uF  C-USC0603  [C0603]
C92  0.1uF  C-USC0603  [C0603]
C93  0.1uF  C-USC0603  [C0603]
C94  0.1uF  C-USC0603  [C0603]
C95  10uF  C-USC1206  [C1206]
C96  10uF  C-USC1206  [C1206]
C97  1uF  C-USC0603  [C0603]
C98  10uF  C-USC1206  [C1206]
C99  0.1uF  C-USC0603  [C0603]
C100  10uF  C-USC1206  [C1206]
C101  10uF  C-USC1206  [C1206]
C102  0.1uF  C-USC0603  [C0603]
C103  0.1uF  C-USC0603  [C0603]
C104  0.1uF  C-USC0603  [C0603]
C105  0.1uF  C-USC0603  [C0603]
C106  0.1uF  C-USC0603  [C0603]
C107  0.1uF  C-USC0603  [C0603]
C108  0.1uF  C-USC0603  [C0603]
C109  0.1uF  C-USC0603  [C0603]
C118  0.1uF  C-USC0603  [C0603]
C119  0.1uF  C-USC0603  [C0603]
C129  0.1uF  C-USC0603  [C0603]
C130  0.1uF  C-USC0603  [C0603]
C131  0.1uF  C-USC0603  [C0603]
IC1  LINEAR_7805DT  [LINEAR_TO252]
IC2  74LS279D  [SO16]
IC3  7400D  [SO14]
IC4  74LS138D  [SO16]
IC5  LMV321M5  [SOT23-5]
IC6  74LS240DW  [SO20W]
JP1  PINHD-1X8  [1X08]
JP2  PINHD-1X8  [1X08]
LED1  LEDCHIPLED_0805  [CHIPLED_0805]
LED2  LEDCHIPLED_0805  [CHIPLED_0805]
LED3  LEDCHIPLED_0805  [CHIPLED_0805]
R000  100  R-US_R0805  [R0805]
R137  100  R-US_R0805  [R0805]
R138  100  R-US_R0805  [R0805]
R139  100  R-US_R0805  [R0805]
R140  100  R-US_R0805  [R0805]
R141  2k  R-US_R0805  [R0805]
R142  330  R-US_R0805  [R0805]
R143  330  R-US_R0805  [R0805]
R144  330  R-US_R0805  [R0805]
R145  2k  R-US_R0805  [R0805]
R146  2k  R-US_R0805  [R0805]
R155  0  R-US_R0603  [R0603]
R156  0  R-US_R0603  [R0603]
R157  0  R-US_R0603  [R0603]
R158  0  R-US_R0603  [R0603]
R159  0  R-US_R0603  [R0603]
R160  0  R-US_R0603  [R0603]
R161  0  R-US_R0603  [R0603]
R162  0  R-US_R0603  [R0603]
R163  10k  R-US_R0603  [R0603]
R172  100  R-US_R0805  [R0805]
R173  330  R-US_R0805  [R0805]
R174  330  R-US_R0805  [R0805]
R175  330  R-US_R0805  [R0805]
R176  330  R-US_R0805  [R0805]
R177  330  R-US_R0805  [R0805]
R178  330  R-US_R0805  [R0805]
R179  330  R-US_R0805  [R0805]
R180  330  R-US_R0805  [R0805]
R181  330  R-US_R0805  [R0805]
R182  330  R-US_R0805  [R0805]
R183  330  R-US_R0805  [R0805]
R184  100  R-US_R0805  [R0805]
U001  65LVDS34  DS9637A  [SO08-1]
U9  LTC2656BCFE-H16PBF  [SOP65P640X120-21N]
U10  LTC1863CGNPBF  [SOP63P600X175-16N]
U011  65LVDS9638  DS9638  [SO08-1]
U021  65LVDS34  DS9637A  [SO08-1]
U025  ACSL-6400  [ACSL-SO16]
U026  ACSL-6420  [ACSL-SO16]
U030  65LVDS34  DS9637A  [SO08-1]
U040  1N4148  [1N4148]
U041  1N4148  [1N4148]
U042  1N4148  [1N4148]
U043  1N4148  [1N4148]
U044  1N4148  [1N4148]
U045  1N4148  [1N4148]
U046  1N4148  [1N4148]
X002  RJ45V  [RJ45-VERTICAL]
X003  RJ45V  [RJ45-VERTICAL]

### Nets
+5V: C89.1 C90.1 C91.1 C92.1 C93.1 C94.1 C97.1 C98.1 C99.1 C101.1 C102.1 C103.1 C104.1 C107.1 C118.1 IC1.2(VO) IC2.16(P:VCC) IC3.14(P:VCC) IC4.6(G1) IC4.16(VCC) IC5.5(V+) IC6.20(P:VCC) LED2.A R141.2 R142.2 R143.2 R144.2 R163.1 R175.2 R176.2 U9.8(~LDAC) U9.14(PORSEL) U9.19(VCC) U10.16(VDD) U025.10(VDD1) U025.15(VDD2) U026.12(VDD2) ; also sheet 1
+5V/1: C105.1 C106.1 C108.1 C109.1 C119.1 C129.1 C130.1 C131.1 R139.2 R173.2 R174.2 U001.1(VCC) U011.1(VCC) U021.1(VCC) U025.1(AN1) U025.3(AN2) U025.5(AN3) U026.4(VDD1) U026.5(AN1) U026.7(AN2) U030.1(VCC) X003.7
ADC_SEL: IC4.14(Y1) U10.11(~CS/CONV)
BOARD: IC4.4(G2A) R142.1 U025.13(OUT2)
BOARD_I: R177.1 U030.2(OUTA) U040.2(C)
BOARD_II: R177.2 U025.4(CATH2) U040.1(A)
BOARD_Y: R137.2 U030.8(INA1) X003.1
BOARD_Z: R137.1 U030.7(INA2) X003.2
DAC_OUT_A: JP2.1 R155.2 ; also sheet 1
DAC_OUT_B: JP2.2 R156.2 ; also sheet 1
DAC_OUT_C: JP2.3 R157.2 ; also sheet 1
DAC_OUT_D: JP2.4 R158.2 ; also sheet 1
DAC_OUT_E: JP2.5 R159.2 ; also sheet 1
DAC_OUT_F: JP2.6 R160.2 ; also sheet 1
DAC_OUT_G: JP2.7 R161.2 ; also sheet 1
DAC_OUT_H: JP2.8 R162.2 ; also sheet 1
DAC_REF: IC5.3(-IN) IC5.4(OUT) ; also sheet 1
DAC_REF_OUT: C85.1 IC5.1(+IN) U9.7(REFIN/OUT)
DAC_SEL: IC4.15(Y0) U9.9(~CS/LD)
FAULT: IC2.6(C:S) IC3.3(A:O)
FAULT_BUFFER: IC3.1(A:I0) IC6.14(A:Y3)
FAULT_OUT: IC6.6(A:A3) ; also sheet 1
FAULT_READ: IC4.13(Y2) IC6.19(B:G)
FAULT_RESET: IC2.5(C:R) IC3.2(A:I1) IC4.12(Y3)
FUNCTION_0: IC4.1(A) R143.1 U025.14(OUT1)
FUNCTION_0_I: R178.1 U030.3(OUTB) U041.2(C)
FUNCTION_0_II: R178.2 U025.2(CATH1) U041.1(A)
FUNCTION_0_Y: R138.1 U030.6(INB1) X003.4
FUNCTION_0_Z: R138.2 U030.5(INB2) X003.5
FUNCTION_1: IC4.2(B) R144.1 U025.12(OUT3)
FUNCTION_1_I: R179.1 U001.2(OUTA) U042.2(C)
FUNCTION_1_II: R179.2 U025.6(CATH3) U042.1(A)
FUNCTION_1_Y: R140.1 U001.8(INA1) X003.6
FUNCTION_1_Z: R140.2 U001.7(INA2) X003.3
GND: C85.2 C86.2 C87.2 C88.2 C89.2 C90.2 C91.2 C92.2 C93.2 C94.2 C95.2 C96.2 C97.2 C98.2 C99.2 C100.2 C101.2 C102.2 C103.2 C104.2 C107.2 C118.2 IC1.3(GND) IC2.8(P:GND) IC3.7(P:GND) IC4.3(C) IC4.5(G2B) IC4.8(GND) IC5.2(V-) IC6.1(A:G) IC6.10(P:GND) R145.1 R146.1 U9.1(REFLO) U9.20(GND) U9.21(EP) U10.15(GND) U025.9(GND1) U025.16(GND2) U026.9(GND2) U026.13(CATH3) U026.15(CATH4) ; also sheet 1
GND1: C105.2 C106.2 C108.2 C109.2 C119.2 C129.2 C130.2 C131.2 R139.1 U001.4(GND) U011.4(GND) U021.4(GND) U026.1(GND1) U030.4(GND) X002.G1(S) X002.G2(S) X003.8 X003.G1(S) X003.G2(S)
ISENSE_0: JP1.1 U10.8(CH7/COM) ; also sheet 1
ISENSE_1: JP1.2 U10.7(CH6) ; also sheet 1
ISENSE_2: JP1.3 U10.6(CH5) ; also sheet 1
ISENSE_3: JP1.4 U10.5(CH4) ; also sheet 1
ISENSE_4: JP1.5 U10.4(CH3) ; also sheet 1
ISENSE_5: JP1.6 U10.3(CH2) ; also sheet 1
ISENSE_6: JP1.7 U10.2(CH1) ; also sheet 1
ISENSE_7: JP1.8 U10.1(CH0) ; also sheet 1
LATCHED_FAULT: IC2.7(C:Q) IC6.4(A:A2) IC6.17(B:A4)
MISO: IC6.2(A:A1) IC6.3(B:Y4) U10.13(SDO)
MISO_A: U011.6(OUTB1) X002.2
MISO_B: U011.5(OUTB2) X002.1
MISO_BUFFER: IC6.18(A:Y1) R183.2 U046.2(C)
MISO_I: R173.1 U011.3(INB) U026.2(OUT4)
MISO_II: R183.1 U026.16(AN4) U046.1(A)
MOSI: R176.1 U9.11(SDI) U10.14(SDI) U026.10(OUT2)
MOSI_A: R000.1 U021.8(INA1) X002.8
MOSI_B: R000.2 U021.7(INA2) X002.7
MOSI_I: R181.1 U021.2(OUTA) U044.2(C)
MOSI_II: R181.2 U026.8(CATH2) U044.1(A)
N$106: R155.1 U9.6(VOUTD)
N$107: R162.1 U9.15(VOUTE)
N$109: R159.1 U9.18(VOUTH)
N$110: R160.1 U9.17(VOUTG)
N$111: R161.1 U9.16(VOUTF)
N$112: R158.1 U9.2(VOUTA)
N$113: LED2.C R145.2
N$114: LED3.A R141.1
N$115: R163.2 R184.2 U9.13(~CLR)
N$116: LED1.C R146.2
N$122: C86.1 U9.4(REFCOMP)
N$123: C87.1 C95.1 U10.9(REFCOMP)
N$124: C88.1 C96.1 U10.10(VREF)
N$125: R157.1 U9.3(VOUTB)
N$127: R156.1 U9.5(VOUTC)
NOT_LATCHED_FAULT: IC6.16(A:Y2) LED3.C R184.1
SCK_MS: IC6.8(A:A4) R175.1 U9.10(SCK) U10.12(SCK) U026.11(OUT1)
SCK_MS_A: R172.1 U021.6(INB1) X002.5
SCK_MS_B: R172.2 U021.5(INB2) X002.4
SCK_MS_I: R180.1 U021.3(OUTB) U043.2(C)
SCK_MS_II: R180.2 U026.6(CATH1) U043.1(A)
SCK_SM: IC6.12(A:Y4) R182.2 U045.2(C)
SCK_SM_A: U011.8(OUTA1) X002.6
SCK_SM_B: U011.7(OUTA2) X002.3
SCK_SM_I: R174.1 U011.2(INA) U026.3(OUT3)
SCK_SM_II: R182.1 U026.14(AN3) U045.1(A)
VCC: C100.1 IC1.1(VI) LED1.A ; also sheet 1
Unconnected: IC2.1(A:R) IC2.2(A:S1) IC2.3(A:S2) IC2.4(A:Q) IC2.9(B:Q) IC2.10(B:R) IC2.11(B:S1) IC2.12(B:S2) IC2.13(D:Q) IC2.14(D:R) IC2.15(D:S) IC3.4(B:I0) IC3.5(B:I1) IC3.6(B:O) IC3.8(C:O) IC3.9(C:I0) IC3.10(C:I1) IC3.11(D:O) IC3.12(D:I0) IC3.13(D:I1) IC4.7(Y7) IC4.9(Y6) IC4.10(Y5) IC4.11(Y4) IC6.5(B:Y3) IC6.7(B:Y2) IC6.9(B:Y1) IC6.11(B:A1) IC6.13(B:A2) IC6.15(B:A3) U001.3(OUTB) U001.5(INB2) U001.6(INB1) U9.12(SDO) U025.7(AN4) U025.8(CATH4) U025.11(OUT4)

## Library data of the parts
C1 C2 C4-C10 C15-C127 C129-C131 = rcl:C-US: CAPACITOR, American symbol; SPICEPREFIX: C
C3 = rcl:C-US: CAPACITOR, American symbol; SPICEPREFIX: 1n
C11-C14 = rcl:CPOL-US: POLARIZED CAPACITOR, American symbol; SPICEPREFIX: C
IC1 = fiberInterface_revC_V2:LINEAR_78*: Positive VOLTAGE REGULATOR Source: http://cache.national.com/ds/LM/LM78L05.pdf http://www.fairchildsemi.com/ds/LM/LM7805.pdf
IC2 = 74xx-us:74*279: Quadruple S-R LATCH
IC3 = 74xx-us:74*00: Quad 2-input NAND gate
IC4 = 74xx-us:74*138: 3-line to 8-line DECODER/DEMULTIPLEXER
IC5 = linear:LMV321?*: General Purpose, Low Voltage, Rail-to-Rail Output Operational Amplifiers Source: http://www.national.com/mpf/LM/LMV321.html http://www.national.com/dt/lmv_qual.pdf
IC6 = 74xx-us:74*240: Octal BUFFER and LINE DRIVER, 3-state
JP1 JP2 = pinhead:PINHD-1X8: PIN HEADER
JP3 JP4 = pinhead:PINHD-1X2: PIN HEADER
JP5 JP6 = pinhead:PINHD-1X1: PIN HEADER
LED1-LED3 = led:LED: LED OSRAM: - CHIPLED LG R971, LG N971, LY N971, LG Q971, LY Q971, LO R971, LY R971 LH N974, LH R974 LS Q976, LO Q976, LY Q976 LO Q996 - Hyper CHIPLED LW Q18S LB Q993, LB Q99A, LB R99A - SideLED LS A670, LO A670, LY A670, LG A670, LP A670 LB A673, LV A673, LT A673, LW A673 LH A674 LY A675 LS A676, LA A676, LO A676, LY A676, LW A676 LS A679, LY A679, LG A679 - Hyper Micro SIDELED® LS Y876, LA Y876, LO Y876, LY Y876 LT Y87S - SmartLED LW L88C, LW L88S LB L89C, LB L89S, LG L890 LS L89K, LO L89K, LY L89K LS L896, LA L896, LO L896, LY L896 - TOPLED LS T670, LO T670, LY T670, LG T670, LP T670 LSG T670, LSP T670, LSY T670, LOP T670, LYG T670 LG T671, LOG T671, LSG T671 LB T673, LV T673, LT T673, LW T673 LH T674 LS T676, LA T676, LO T676, LY T676, LB T676, LH T676, LSB T676, LW T676 LB T67C, LV T67C, LT T67C, LS T67K, LO T67K, LY T67K, LW E67C LS E67B, LA E67B, LO E67B, LY E67B, LB E67C, LV E67C, LT E67C LW T67C LS T679, LY T679, LG T679 LS T770, LO T770, LY T770, LG T770, LP T770 LB T773, LV T773, LT T773, LW T773 LH T774 LS E675, LA E675, LY E675, LS T675 LS T776, LA T776, LO T776, LY T776, LB T776 LHGB T686 LT T68C, LB T68C - Hyper Mini TOPLED® LB M676 - Mini TOPLED Santana® LG M470 LS M47K, LO M47K, LY M47K Source: http://www.osram.convergy.de LUXEON: - LUMILED® LXK2-PW12-R00, LXK2-PW12-S00, LXK2-PW14-U00, LXK2-PW14-V00 LXK2-PM12-R00, LXK2-PM12-S00, LXK2-PM14-U00 LXK2-PE12-Q00, LXK2-PE12-R00, LXK2-PE12-S00, LXK2-PE14-T00, LXK2-PE14-U00 LXK2-PB12-K00, LXK2-PB12-L00, LXK2-PB12-M00, LXK2-PB14-N00, LXK2-PB14-P00, LXK2-PB14-Q00 LXK2-PR12-L00, LXK2-PR12-M00, LXK2-PR14-Q00, LXK2-PR14-R00 LXK2-PD12-Q00, LXK2-PD12-R00, LXK2-PD12-S00 LXK2-PH12-R00, LXK2-PH12-S00 LXK2-PL12-P00, LXK2-PL12-Q00, LXK2-PL12-R00 Source: www.luxeon.com KINGBRIGHT: KA-3528ASYC Source: www.kingbright.com
P1-P8 = con-molex-mini-fit:39-30-?02?_S: HEADER
P9 = con-molex-mini-fit:39-30-?10?_S: HEADER
R000 R137-R140 R172 R184 = rcl:R-US_: RESISTOR, American symbol; SPICEPREFIX: 100
R1-R136 R145-R171 R185-R192 = rcl:R-US_: RESISTOR, American symbol; SPICEPREFIX: R
R141 = rcl:R-US_: RESISTOR, American symbol; SPICEPREFIX: 2k
R142-R144 R173-R183 = rcl:R-US_: RESISTOR, American symbol; SPICEPREFIX: 330
U001 U021 U030 = 74xx-us:DS9637A
U2 U3 U6 U8 U13 U15 U17 U19 = Texas Instruments_By_element14_Batch_1:INA170EA/250: Bidirectional CURRENT SHUNT MONITOR; MPN: INA170EA/250; OC_FARNELL: -; OC_NEWARK: 74C9833; PACKAGE: MSOP-8; SUPPLIER: Texas Instruments
U4 U5 U7 U12 U14 U16 U18 U20 = Texas Instruments_By_element14_Batch_1:OPA2340EA/250: OPERATIONAL AMPLIFIERS; MPN: OPA2340EA/250; OC_FARNELL: 1101540; OC_NEWARK: 36K7580; PACKAGE: MSOP-8; SUPPLIER: Texas Instruments
U9 = LTC_By_element14_Batch_1:LTC2656BCFE-H16PBF: Octal DACs with 10ppm/°C Max Reference; MPN: LTC2656BCFE-H16#PBF; OC_FARNELL: -; OC_NEWARK: 28R7619; PACKAGE: TSSOP-20; SUPPLIER: Linear Technology
U10 = LTC_By_element14_Batch_1:LTC1863CGNPBF: ADC; MPN: LTC1863CGN#PBF; OC_FARNELL: 1503394; OC_NEWARK: 56M4074; PACKAGE: SSOP-16; SUPPLIER: Linear Technology
U011 = 74xx-us:DS9638
U025 = ACSL-6xx0:ACSL-6400: Quad-Channel All-in-One Optocoupler
U026 = ACSL-6xx0:ACSL-6420: Quad-Channel Bi-Directional Optocoupler
U031 = fuse:0881070
U040-U046 = 1N4148:1N4148
U$1-U$16 = MIT-GPA:OPA549_HS677: TI OPA549 with Wakefield Series 677 heat sink in the dimensions. NOTE: The heat sink carries the V- potential, but should NEVER be used to carry current !!!
X002 X003 = con-tycoelectronics:RJ45V